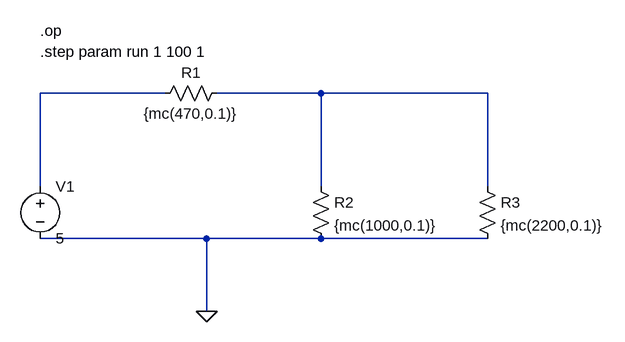
[diagram p0: schematic voltage-div-load.asc]
voltage-div-load.asc, the LTspice schematic file:
Version 4.1
SHEET 1 888 680
WIRE 176 -32 -16 -32
WIRE 416 -32 256 -32
WIRE 672 -32 416 -32
WIRE -16 112 -16 -32
WIRE 416 112 416 -32
WIRE 672 112 672 -32
WIRE 240 192 -16 192
WIRE 416 192 240 192
WIRE 672 192 416 192
WIRE 240 304 240 192
FLAG 240 304 0
SYMBOL voltage -16 96 R0
WINDOW 123 0 0 Left 0
WINDOW 39 0 0 Left 0
SYMATTR InstName V1
SYMATTR Value 5
SYMBOL res 272 -48 R90
WINDOW 0 0 56 VBottom 2
WINDOW 3 32 56 VTop 2
SYMATTR InstName R1
SYMATTR Value {mc(470,0.1)}
SYMATTR SpiceLine tol=10
SYMBOL res 400 96 R0
SYMATTR InstName R2
SYMATTR Value {mc(1000,0.1)}
SYMATTR SpiceLine tol=10
SYMBOL res 656 96 R0
SYMATTR InstName R3
SYMATTR Value {mc(2200,0.1)}
SYMATTR SpiceLine tol=10
TEXT -16 -128 Left 2 !.op
TEXT -16 -96 Left 2 !.step param run 1 100 1

The netlist it stands for:
* voltage-div-load.asc
V1 N001 0 5
R1 N002 N001 {mc(470,0.1)} tol=10
R2 N002 0 {mc(1000,0.1)} tol=10
R3 N002 0 {mc(2200,0.1)} tol=10
.op
.step param run 1 100 1
.backanno
.end